# Altium schematic sheet [03]-LED7SEG.SchDoc
size A
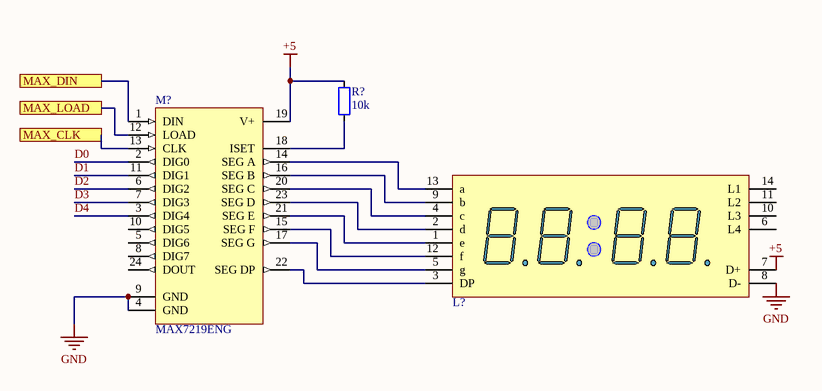
[diagram p0: [03]-LED7SEG.SchDoc]

## Parts
L?  Led 7 Seg 4 digit - Anode  [LED7SED-4-A]  (value not drawn)
M?  MAX7219ENG  [SO24]
R?  10k  [RES-1/2W]

## Ports
MAX_CLK, MAX_DIN, MAX_LOAD

## Nets
+5: L?.7(D+) M?.19(V+) R?.2
GND: L?.8(D-) M?.4(GND) M?.9(GND)
D0: M?.2(DIG0)
D1: M?.11(DIG1)
D2: M?.6(DIG2)
D3: M?.7(DIG3)
D4: M?.3(DIG4)
MAX_CLK: M?.13(CLK) ; port MAX_CLK
MAX_DIN: M?.1(DIN) ; port MAX_DIN
MAX_LOAD: M?.12(LOAD) ; port MAX_LOAD
NetL?_1: L?.1(e) M?.21(SEG_E)
NetL?_2: L?.2(d) M?.23(SEG_D)
NetL?_3: L?.3(DP) M?.22(SEG_DP)
NetL?_4: L?.4(c) M?.20(SEG_C)
NetL?_5: L?.5(g) M?.17(SEG_G)
NetL?_9: L?.9(b) M?.16(SEG_B)
NetL?_12: L?.12(f) M?.15(SEG_F)
NetL?_13: L?.13(a) M?.14(SEG_A)
NetM?_18: M?.18(ISET) R?.1

Not connected (* = marked no-connect by the designer): L? 6(L4) 10(L3) 11(L2) 14(L1); M? 5(DIG6) 8(DIG7) 10(DIG5) 24(DOUT)

## Library data of the parts
L? = LED7SEG-4DIGIT-A
M? = MAX7219ENG: Serially Interfaced, 8-Digit LED Display Driver; Published: 16-Jan-2001; LatestRevisionDate: 29-May-2009; LatestRevisionNote: Component Body Added.; DatasheetVersion: Jul-1997; PackageVersion: 1997; PackageReference: NG24A; Publisher: Altium Limited; PackageDescription: DIP, 24-Pin, Row Spacing 7.62 mm, Pitch 2.54 mm; Code_JEDEC: MS-001-AF; ComponentLink1Description: Manufacturer Link; ComponentLink1URL: http://www.maxim-ic.com/; ComponentLink2Description: Datasheet; ComponentLink2URL: http://pdfserv.maxim-ic.com/en/ds/MAX7219-MAX7221.pdf
R? = Resistor - DIP: Value: R1/4W - 1K